# Altium schematic sheet Sheet1.SchDoc
size A4
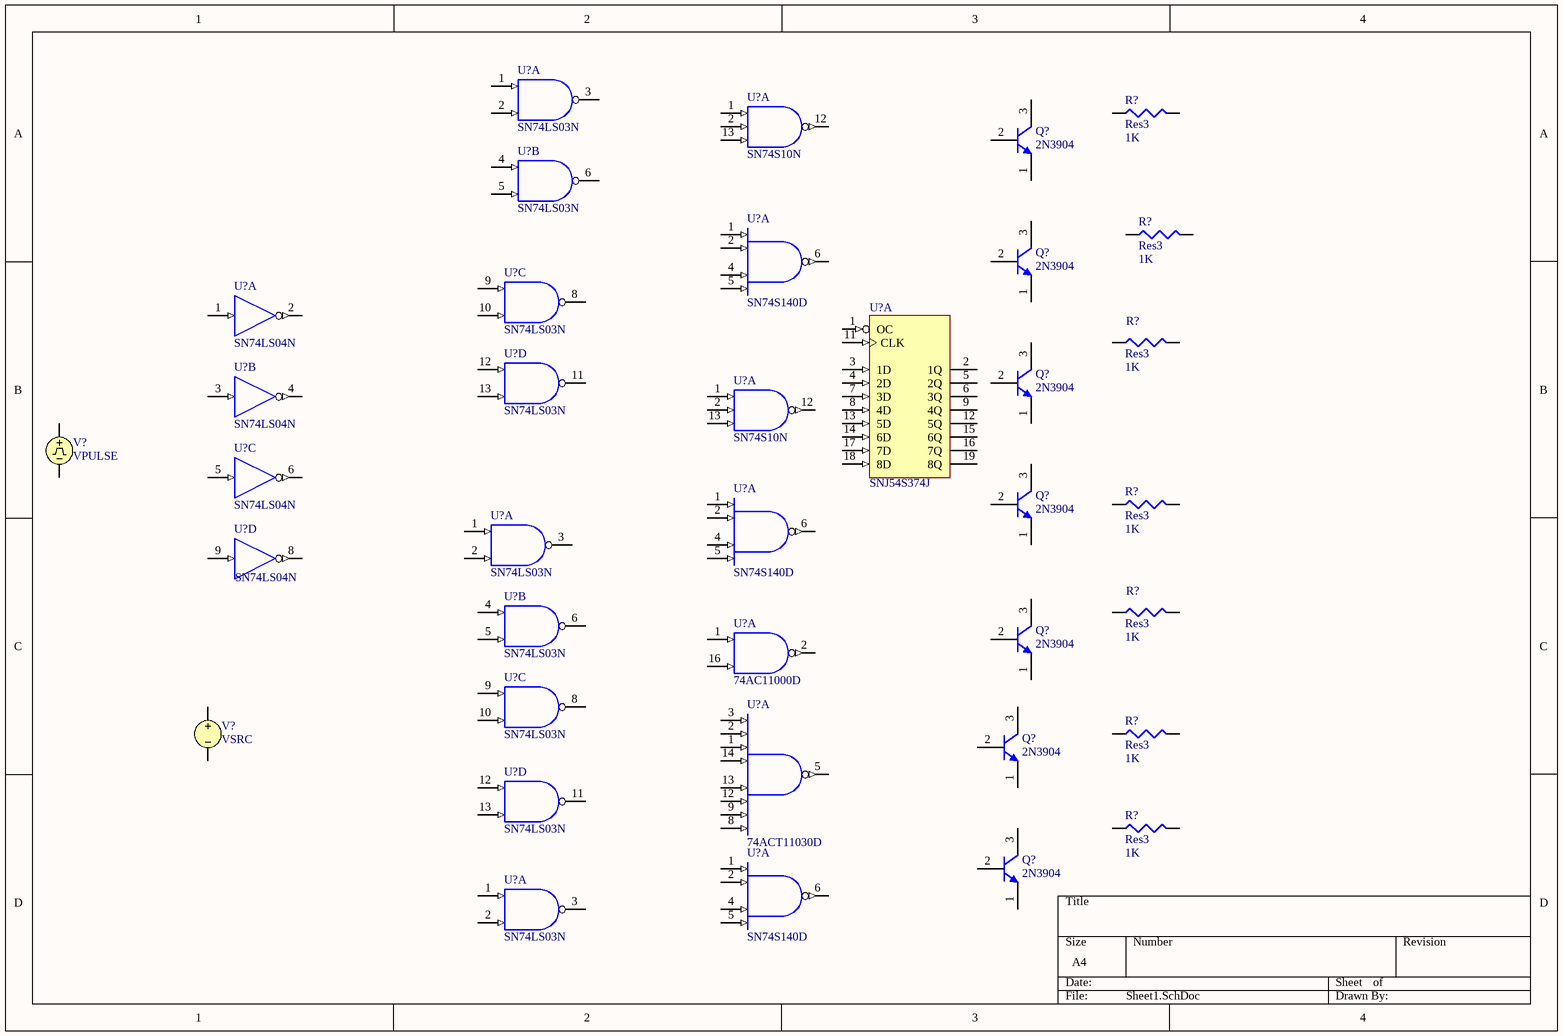
[diagram p0: Sheet1.SchDoc]

## Parts
(Parts that share a designator on the sheet are numbered #1, #2 ... from top to bottom, then left to right.)
Q?#1  2N3904  [ONSC-TO-92-3-29-11]
Q?#2  2N3904  [ONSC-TO-92-3-29-11]
Q?#3  2N3904  [ONSC-TO-92-3-29-11]
Q?#4  2N3904  [ONSC-TO-92-3-29-11]
Q?#5  2N3904  [ONSC-TO-92-3-29-11]
Q?#6  2N3904  [ONSC-TO-92-3-29-11]
Q?#7  2N3904  [ONSC-TO-92-3-29-11]
R?#1  Res3  value 1K  [J1-0603]
R?#2  Res3  value 1K  [J1-0603]
R?#3  Res3  value 1K  [J1-0603]
R?#4  Res3  value 1K  [J1-0603]
R?#5  Res3  value 1K  [J1-0603]
R?#6  Res3  value 1K  [J1-0603]
R?#7  Res3  value 1K  [J1-0603]
U?#1  SN74LS03N  [N0014A]  (part A of 5)
U?#2  SN74S10N  [N0014A]  (part A of 4)
U?#3  SN74LS03N  [N0014A]  (part B of 5)
U?#4  SN74S140D  [D0014A_N]  (part A of 3)
U?#5  SN74LS03N  [N0014A]  (part C of 5)
U?#6  SN74LS04N  [N0014A]  (part A of 7)
U?#7  SNJ54S374J  [J0020A]  (part A of 2)
U?#8  SN74LS03N  [N0014A]  (part D of 5)
U?#9  SN74LS04N  [N0014A]  (part B of 7)
U?#10  SN74S10N  [N0014A]  (part A of 4)
U?#11  SN74LS04N  [N0014A]  (part C of 7)
U?#12  SN74S140D  [D0014A_N]  (part A of 3)
U?#13  SN74LS03N  [N0014A]  (part A of 5)
U?#14  SN74LS04N  [N0014A]  (part D of 7)
U?#15  SN74LS03N  [N0014A]  (part B of 5)
U?#16  74AC11000D  [D0016A_N]  (part A of 5)
U?#17  SN74LS03N  [N0014A]  (part C of 5)
U?#18  74ACT11030D  [D0014A_N]  (part A of 3)
U?#19  SN74LS03N  [N0014A]  (part D of 5)
U?#20  SN74S140D  [D0014A_N]  (part A of 3)
U?#21  SN74LS03N  [N0014A]  (part A of 5)
V?#1  VPULSE
V?#2  VSRC

## Nets

Not connected (* = marked no-connect by the designer): Q?#1 1(E) 2(B) 3(C); Q?#2 1(E) 2(B) 3(C); Q?#3 1(E) 2(B) 3(C); Q?#4 1(E) 2(B) 3(C); Q?#5 1(E) 2(B) 3(C); Q?#6 1(E) 2(B) 3(C); Q?#7 1(E) 2(B) 3(C); R?#1 1 2; R?#2 1 2; R?#3 1 2; R?#4 1 2; R?#5 1 2; R?#6 1 2; R?#7 1 2; U?#1 1(1A) 2(1B) 3(1Y); U?#2 1(1A) 2(1B) 12(1Y) 13(1C); U?#3 4(2A) 5(2B) 6(2Y); U?#4 1(1A) 2(1B) 4(1C) 5(1D) 6(1Y); U?#5 8(3Y) 9(3A) 10(3B); U?#6 1(1A) 2(~{1Y}); U?#7 1(OC) 2(1Q) 3(1D) 4(2D) 5(2Q) 6(3Q) 7(3D) 8(4D) 9(4Q) 11(CLK) 12(5Q) 13(5D) 14(6D) 15(6Q) 16(7Q) 17(7D) 18(8D) 19(8Q); U?#8 11(4Y) 12(4A) 13(4B); U?#9 3(2A) 4(~{2Y}); U?#10 1(1A) 2(1B) 12(1Y) 13(1C); U?#11 5(3A) 6(~{3Y}); U?#12 1(1A) 2(1B) 4(1C) 5(1D) 6(1Y); U?#13 1(1A) 2(1B) 3(1Y); U?#14 8(~{4Y}) 9(4A); U?#15 4(2A) 5(2B) 6(2Y); U?#16 1(1A) 2(1Y) 16(1B); U?#17 8(3Y) 9(3A) 10(3B); U?#18 1(C) 2(B) 3(A) 5(Y) 8(H) 9(G) 12(F) 13(E) 14(D); U?#19 11(4Y) 12(4A) 13(4B); U?#20 1(1A) 2(1B) 4(1C) 5(1D) 6(1Y); U?#21 1(1A) 2(1B) 3(1Y); V?#1 1 2; V?#2 1 2

## Library data of the parts
Q?#1-Q?#7 = CMP-2000-05562-1: General Purpose Transistor, NPN Silicon, 200 mA, 60 V, -55 to 150 degC, 3-Pin TO-92, RoHS, Bulk; Manufacturer: ONSemiconductor; Emitter- Base Voltage VEBO: 6V; Maximum Power Dissipation: 625mW; Maximum DC Collector Current: 0.2A; Collector- Emitter Voltage VCEO Max: 40V; Collector- Base Voltage VCBO: 60V; DC Collector/Base Gain hfe Min: 60; Configuration: Single; Collector-Emitter Saturation Voltage: 0.3V; Gain Bandwidth Product fT: 270MHz; Mounting Style: ThroughHole; Package / Case: TO-92-3(TO-226); Mounting Technology: ThroughHole; Minimum Operating Temperature: -65C; Datasheet Version: Rev. 8, 08/2012; Product Category: BipolarTransistors-BJT; Factory Pack Quantity: 5000; Transistor Polarity: NPN; Package Description: 3-Pin Transistor Outline, Body 4.825 x 3.685 mm, Pitch 1.27 mm; RoHS: Details; Datasheet URL: https://datasheet.ciiva.com/4725/2n3903-d-285841-4725808.pdf; Packaging: Bulk; Maximum Operating Temperature: +150C; Package Reference: TO-92-3-29-11; Brand: ONSemiconductor; Manufacturer URL: http://www.onsemi.com/
R?#1-R?#7 = Res3: Resistor; Published: 8-Jun-2000; LatestRevisionDate: 29-May-2009; LatestRevisionNote: IPC-7351 Footprint Added.; PackageReference: J1-0603; Publisher: Altium Limited; PackageDescription: Chip Resistor
U?#1 U?#3 U?#5 U?#8 U?#13 U?#15 U?#17 U?#19 U?#21 = CMP-1627-00475-2: Quad 2-input positive-NAND gates with open collector outputs, N0014A, TUBE; Manufacturer: Texas Instruments; VCC(Min)(V): 4.75; VCC(Max)(V): 5.25; Rating: Catalog; Technology Family: LS; Output Drive (IOL/IOH)(Max)(mA): 0/-16; Output Type: TTL; Schmitt Trigger: No; Voltage(Nom)(V): 5; ICC @ Nom Voltage(Max)(mA): 0.022; F @ Nom Voltage(Max)(Mhz): 35; tpd @ Nom Voltage(Max)(ns): 45; Bits(#): 4; PackageReference: N0014A; Operating Temperature Range(C): 0 to 70; DatasheetVersion: SDLS028; Generic Part Number: SN74LS03; Code_JEDEC: MS-001; Input Type: TTL
U?#2 = SN74S10N: Triple 3-input positive-NAND gates, N0014A, TUBE; Manufacturer: Texas Instruments; VCC(Min)(V): 4.75; VCC(Max)(V): 5.25; Output Type: TTL; ICC @ Nom Voltage(Max)(mA): 0.0165; Bits(#): 3; F @ Nom Voltage(Max)(Mhz): 50; Rating: Catalog; Technology Family: S; Voltage(Nom)(V): 5; Schmitt Trigger: No; Output Drive (IOL/IOH)(Max)(mA): 0.4/-16; tpd @ Nom Voltage(Max)(ns): 22; DatasheetVersion: SDLS035A; PackageReference: N0014A; Supplier 1: Mouser; Supplier Part Number 1: 595-SN74S10N; Supplier 2: Digi-Key; Supplier Part Number 2: 296-14937-5-ND; Generic Part Number: SN74S10; Input Type: TTL; Operating Temperature Range(C): 0 to 70; Code_JEDEC: MS-001; PartNumber: SN74S10N; ComponentLink1Description: Manufacturer URL; ComponentLink1URL: http://www.ti.com/; ComponentLink2Description: Datasheet; ComponentLink2URL: http://www.ti.com/lit/ds/symlink/sn74s10.pdf; ComponentLink3Description: Package Specification; ComponentLink3URL: http://www.ti.com/lit/ml/mpdi002c/mpdi002c.pdf
U?#4 U?#12 U?#20 = SN74S140D: Dual 4-input positive-NAND 50-Ohm line drivers, D0014A, TUBE; Manufacturer: Texas Instruments; VCC(Min)(V): 4.75; VCC(Max)(V): 5.25; Output Type: TTL; ICC @ Nom Voltage(Max)(mA): 0.044; Bits(#): 2; F @ Nom Voltage(Max)(Mhz): 50; Rating: Catalog; Technology Family: S; Voltage(Nom)(V): 5; Schmitt Trigger: No; Output Drive (IOL/IOH)(Max)(mA): 40/-60; tpd @ Nom Voltage(Max)(ns): 6.5; DatasheetVersion: SDLS210; PackageReference: D0014A; Supplier 1: Mouser; Supplier Part Number 1: 595-SN74S140D; Supplier 2: Digi-Key; Supplier Part Number 2: 296-3860-5-ND; Generic Part Number: SN74S140; Input Type: TTL; Operating Temperature Range(C): 0 to 70; Code_JEDEC: MS-012; PartNumber: SN74S140D; ComponentLink1Description: Manufacturer URL; ComponentLink1URL: http://www.ti.com/; ComponentLink2Description: Datasheet; ComponentLink2URL: http://www.ti.com/lit/ds/symlink/sn74s140.pdf; ComponentLink3Description: Package Specification; ComponentLink3URL: http://www.ti.com/lit/ml/mpds177g/mpds177g.pdf
U?#6 U?#9 U?#11 U?#14 = CMP-1615-00911-2: Hex inverters, N0014A, TUBE; Manufacturer: Texas Instruments; Output Drive (IOL/IOH)(Max)(mA): -0.4/8; Schmitt Trigger: No; F @ Nom Voltage(Max)(Mhz): 35; Voltage(Nom)(V): 5; Technology Family: LS; Input Type: TTL; Output Type: CMOS; Bits(#): 6; VCC(Max)(V): 5.25; ICC @ Nom Voltage(Max)(mA): 0.033; Rating: Catalog; VCC(Min)(V): 4.75; tpd @ Nom Voltage(Max)(ns): 22; Operating Temperature Range(C): 0 to 70; DatasheetVersion: SDLS029C; Generic Part Number: SN74LS04; Code_JEDEC: MS-001; PackageReference: N0014A
U?#7 = SNJ54S374J: Octal D-Type Positive Edge Triggered Flip-Flops with 3-State Outputs, J0020A, TUBE; Generic Part Number: SN54S374; Manufacturer: Texas Instruments; VCC(Min)(V): 4.75; VCC(Max)(V): 5.25; Output Type: TTL; ICC @ Nom Voltage(Max)(mA): 0.18; Bits(#): 8; F @ Nom Voltage(Max)(Mhz): 50; Rating: Military; Technology Family: S; Schmitt Trigger: No; Output Drive (IOL/IOH)(Max)(mA): 20/-6.5; Output Logic: Non-inverted; 3-State Output: Yes; tpd @ Nom Voltage(Max)(ns): 17; DatasheetVersion: SDLS165B; PackageReference: J0020A; Input Type: TTL; Operating Temperature Range(C): -55 to 125; PartNumber: SNJ54S374J; ComponentLink1Description: Manufacturer URL; ComponentLink1URL: http://www.ti.com/; ComponentLink2Description: Datasheet; ComponentLink2URL: http://www.ti.com/lit/ds/symlink/sn54s374.pdf; ComponentLink3Description: Package Specification; ComponentLink3URL: http://www.ti.com/lit/ml/mcer002d/mcer002d.pdf
U?#10 = CMP-1627-00454-2: Triple 3-input positive-NAND gates, N0014A, TUBE; Manufacturer: Texas Instruments; Rating: Catalog; Technology Family: S; Output Drive (IOL/IOH)(Max)(mA): 0.4/-16; Output Type: TTL; VCC(Max)(V): 5.25; ICC @ Nom Voltage(Max)(mA): 0.0165; tpd @ Nom Voltage(Max)(ns): 22; Voltage(Nom)(V): 5; Schmitt Trigger: No; F @ Nom Voltage(Max)(Mhz): 50; VCC(Min)(V): 4.75; Bits(#): 3; PackageReference: N0014A; Code_JEDEC: MS-001; DatasheetVersion: SDLS035A; Generic Part Number: SN74S10; Input Type: TTL; Operating Temperature Range(C): 0 to 70
U?#16 = 74AC11000D: Quadruple 2-Input Positive-NAND Gates, D0016A, TUBE; Manufacturer: Texas Instruments; VCC(Min)(V): 3; VCC(Max)(V): 5.5; Output Type: CMOS; ICC @ Nom Voltage(Max)(mA): 0.04; Bits(#): 4; F @ Nom Voltage(Max)(Mhz): 100; Rating: Catalog; Technology Family: AC; Voltage(Nom)(V): 3.3,5; Schmitt Trigger: No; Output Drive (IOL/IOH)(Max)(mA): 24/-24; tpd @ Nom Voltage(Max)(ns): 11.1,7.4; DatasheetVersion: SCLS054B; PackageReference: D0016A; Supplier 1: Mouser; Supplier Part Number 1: 595-74AC11000D; Supplier 2: Digi-Key; Supplier Part Number 2: 296-32788-5-ND; Generic Part Number: 74AC11000; Input Type: CMOS; Operating Temperature Range(C): -40 to 85; Code_JEDEC: MS-012 variation AC; PartNumber: 74AC11000D; ComponentLink1Description: Manufacturer URL; ComponentLink1URL: http://www.ti.com/; ComponentLink2Description: Datasheet; ComponentLink2URL: http://www.ti.com/lit/ds/symlink/74ac11000.pdf; ComponentLink3Description: Package Specification; ComponentLink3URL: http://www.ti.com/lit/ml/mpds178g/mpds178g.pdf
U?#18 = 74ACT11030D: 8-Input Positive-NAND Gates, D0014A, TUBE; Manufacturer: Texas Instruments; VCC(Min)(V): 4.5; VCC(Max)(V): 5.5; Output Type: CMOS; ICC @ Nom Voltage(Max)(mA): 0.04; Input Type: TTL; Bits(#): 1; F @ Nom Voltage(Max)(Mhz): 90; Rating: Catalog; Technology Family: ACT; Voltage(Nom)(V): 5; Schmitt Trigger: No; Output Drive (IOL/IOH)(Max)(mA): 24/-24; tpd @ Nom Voltage(Max)(ns): 8.7; DatasheetVersion: SCLS050; PackageReference: D0014A; Supplier 1: Mouser; Supplier Part Number 1: 595-74ACT11030D; Supplier 2: Digi-Key; Supplier Part Number 2: 74ACT11030D-ND; Generic Part Number: 74ACT11030; Operating Temperature Range(C): -40 to 85; Code_JEDEC: MS-012; PartNumber: 74ACT11030D; ComponentLink1Description: Manufacturer URL; ComponentLink1URL: http://www.ti.com/; ComponentLink2Description: Datasheet; ComponentLink2URL: http://www.ti.com/lit/ds/symlink/74act11030.pdf; ComponentLink3Description: Package Specification; ComponentLink3URL: http://www.ti.com/lit/ml/mpds177g/mpds177g.pdf
V?#1 = VPULSE: Pulse Voltage Source; Note: PCB Footprint - Not required; Published: 8-Jun-2000; LatestRevisionDate: 15-Nov-2004; LatestRevisionNote: Corrected Netlist.; PackageReference: Not Applicable; Publisher: Altium Limited
V?#2 = VSRC: Voltage Source; Note: PCB Footprint - Not required; Published: 8-Jun-2000; LatestRevisionDate: 17-Jul-2002; LatestRevisionNote: Re-released for DXP Platform.; PackageReference: Not Applicable; Publisher: Altium Limited